# Altium schematic sheet USBConverter.SchDoc
size A4
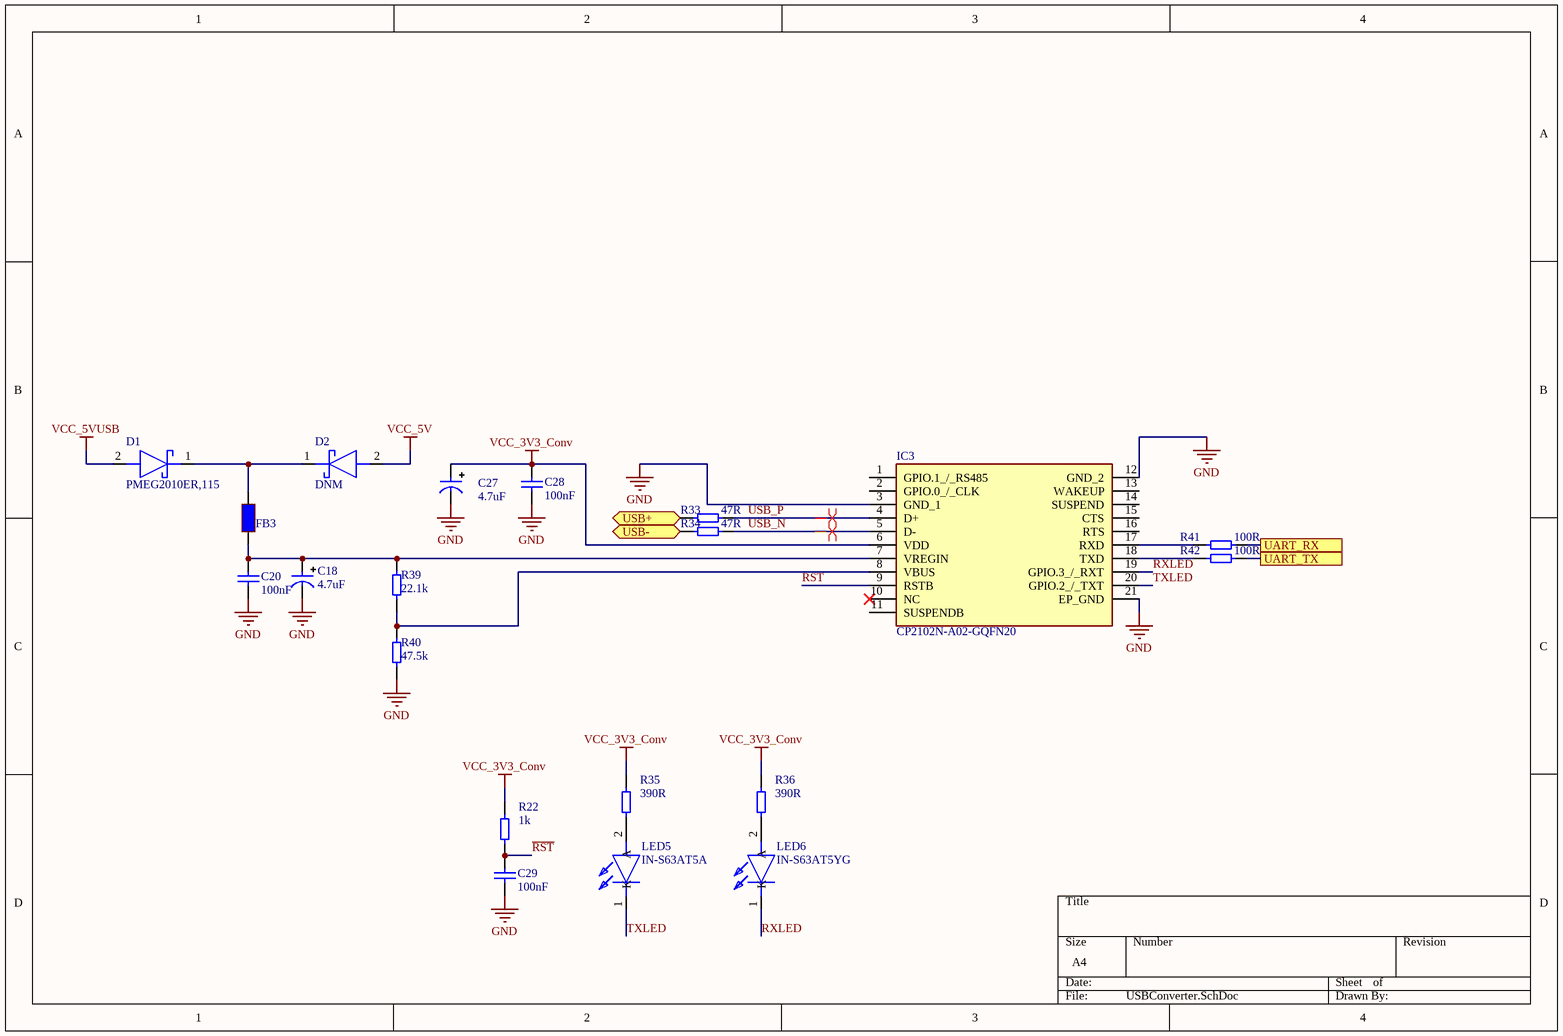
[diagram p0: USBConverter.SchDoc]

## Parts
C18  4.7uF  [A_3216]
C20  100nF  [0603-Capacitor]
C27  4.7uF  [A_3216]
C28  100nF  [0603-Capacitor]
C29  100nF  [0603-Capacitor]
D1  PMEG2010ER,115  [SODFL3517X110N]
D2  DNM  [SODFL3517X110N]
FB3  BLM18HE152SN1D  [0603-Ferrite bead]  (value not drawn)
IC3  CP2102N-A02-GQFN20  [CP2102NA02GQFN20]
LED5  IN-S63AT5A  [LEDM168X39N]
LED6  IN-S63AT5YG  [LEDM168X39N]
R22  1k  [0603-Resistor]
R33  47R  [0603-Resistor]
R34  47R  [0603-Resistor]
R35  390R  [0603-Resistor]
R36  390R  [0603-Resistor]
R39  22.1k  [0603-Resistor]
R40  47.5k  [0603-Resistor]
R41  100R  [0603-Resistor]
R42  100R  [0603-Resistor]

## Ports
UART_RX, UART_TX, USB+ (bidir), USB- (bidir)

## Nets
GND: C18.2 C20.2 C27.2 C28.2 C29.2 IC3.3(GND_1) IC3.12(GND_2) IC3.21(EP_GND) R40.2
VCC_3V3_Conv: C27.1 C28.1 IC3.6(VDD) R22.2 R35.2 R36.2
VCC_5V: D2.2(A)
VCC_5VUSB: D1.2(A)
~{RST}: C29.1 IC3.9(RSTB) R22.1
RXLED: IC3.19(GPIO.3_/_RXT) LED6.1(K)
TXLED: IC3.20(GPIO.2_/_TXT) LED5.1(K)
UART_RX: R41.1 ; port UART_RX
UART_TX: R42.1 ; port UART_TX
USB+: R33.2 ; port USB+
USB-: R34.2 ; port USB-
USB_N: IC3.5(D-) R34.1
USB_P: IC3.4(D+) R33.1
NetC18_1: C18.1 C20.1 FB3.1 IC3.7(VREGIN) R39.1
NetD1_1: D1.1(K) D2.1(K) FB3.2
NetIC3_8: IC3.8(VBUS) R39.2 R40.1
NetIC3_17: IC3.17(RXD) R41.2
NetIC3_18: IC3.18(TXD) R42.2
NetLED5_2: LED5.2(A) R35.1
NetLED6_2: LED6.2(A) R36.1

Not connected (* = marked no-connect by the designer): IC3 1(GPIO.1_/_RS485) 2(GPIO.0_/_CLK) 10(NC)* 11(SUSPENDB) 13(WAKEUP) 14(SUSPEND) 15(CTS) 16(RTS)

## Layout directives
differential pair: USB_N, USB_P

## Library data of the parts
C18 C27 = C_Case_A_3216: Polarized Tantalum Capacitor; Manufacturer: AVX; ManufacturerNr: TAJA475K010RNJV; Voltage Rating: 10V; Part Number: C_Case_A_3216; Pin Count: 2; Package: A; Value: 4.7uF
C20 C28 C29 = C0603: Capacitor; Part Number: C0603; Pin Count: 2; Manufacturer: *; Package: 0603; ManufacturerNr: *; Value: 100nF; Voltage Rating: *; Dielectric: *
D1 D2 = PMEG2010ER,115: Schottky Diode; Manufacturer_Name: Nexperia; Datasheet Link: https://assets.nexperia.com/documents/data-sheet/PMEG2010ER.pdf; Height: 1.1mm; Manufacturer_Part_Number: PMEG2010ER,115; Mouser Part Number: 771-PMEG2010ER115; Mouser Price/Stock: https://www.mouser.com/Search/Refine.aspx?Keyword=771-PMEG2010ER115; RS Part Number: 8166824P; RS Price/Stock: http://uk.rs-online.com/web/p/products/8166824P
FB3 = BLM18HE152SN1D: Ferrite Bead; Manufacturer: Murata; Value: 1.5k; Part Number: BLM18HE152SN1D; Pin Count: 2; Package: 0603; ManufacturerNr: BLM18HE152SN1D
IC3 = CP2102N-A02-GQFN20: Integrated Circuit; Manufacturer_Name: Silicon Labs; Datasheet Link: https://www.silabs.com/documents/public/data-sheets/cp2102n-datasheet.pdf; Height: 0.8mm; Manufacturer_Part_Number: CP2102N-A02-GQFN20; Mouser Part Number: 634-CP2102NA02GQFN20; Mouser Price/Stock: https://www.mouser.com/Search/Refine.aspx?Keyword=634-CP2102NA02GQFN20; RS Part Number: 1871330; RS Price/Stock: http://uk.rs-online.com/web/p/products/1871330
LED5 LED6 = IN-S63AT5G: LED; Manufacturer_Name: Inolux; Datasheet Link: http://www.inolux-corp.com/datasheet/SMDLED/Mono%20Color%20Top%20View/IN-S63AT%20Series_V1.1.pdf; Height: 0.39mm; Mouser Part Number: 743-IN-S63AT5G; Mouser Price/Stock: https://www.mouser.com/Search/Refine.aspx?Keyword=743-IN-S63AT5G
  LED5: Manufacturer_Part_Number: IN-S63AT5A
  LED6: Manufacturer_Part_Number: IN-S63AT5YG
R22 R33 R34 R39-R42 = R0603: Resistor; Part Number: R0603; Pin Count: 2; Manufacturer: *; Package: 0603; ManufacturerNr: *
  R22: Value: 1k
  R33 R34: Value: 47R
  R39: Value: 22.1k
  R40: Value: 47.5k
  R41 R42: Value: 100R
R35 R36 = R0603: Resistor; Part Number: R0603; Value: 680R; Pin Count: 2; Manufacturer: *; Package: 0603; ManufacturerNr: *